# Altium project OSD335-X_Devboard.PrjPcb (part 1 of 3)
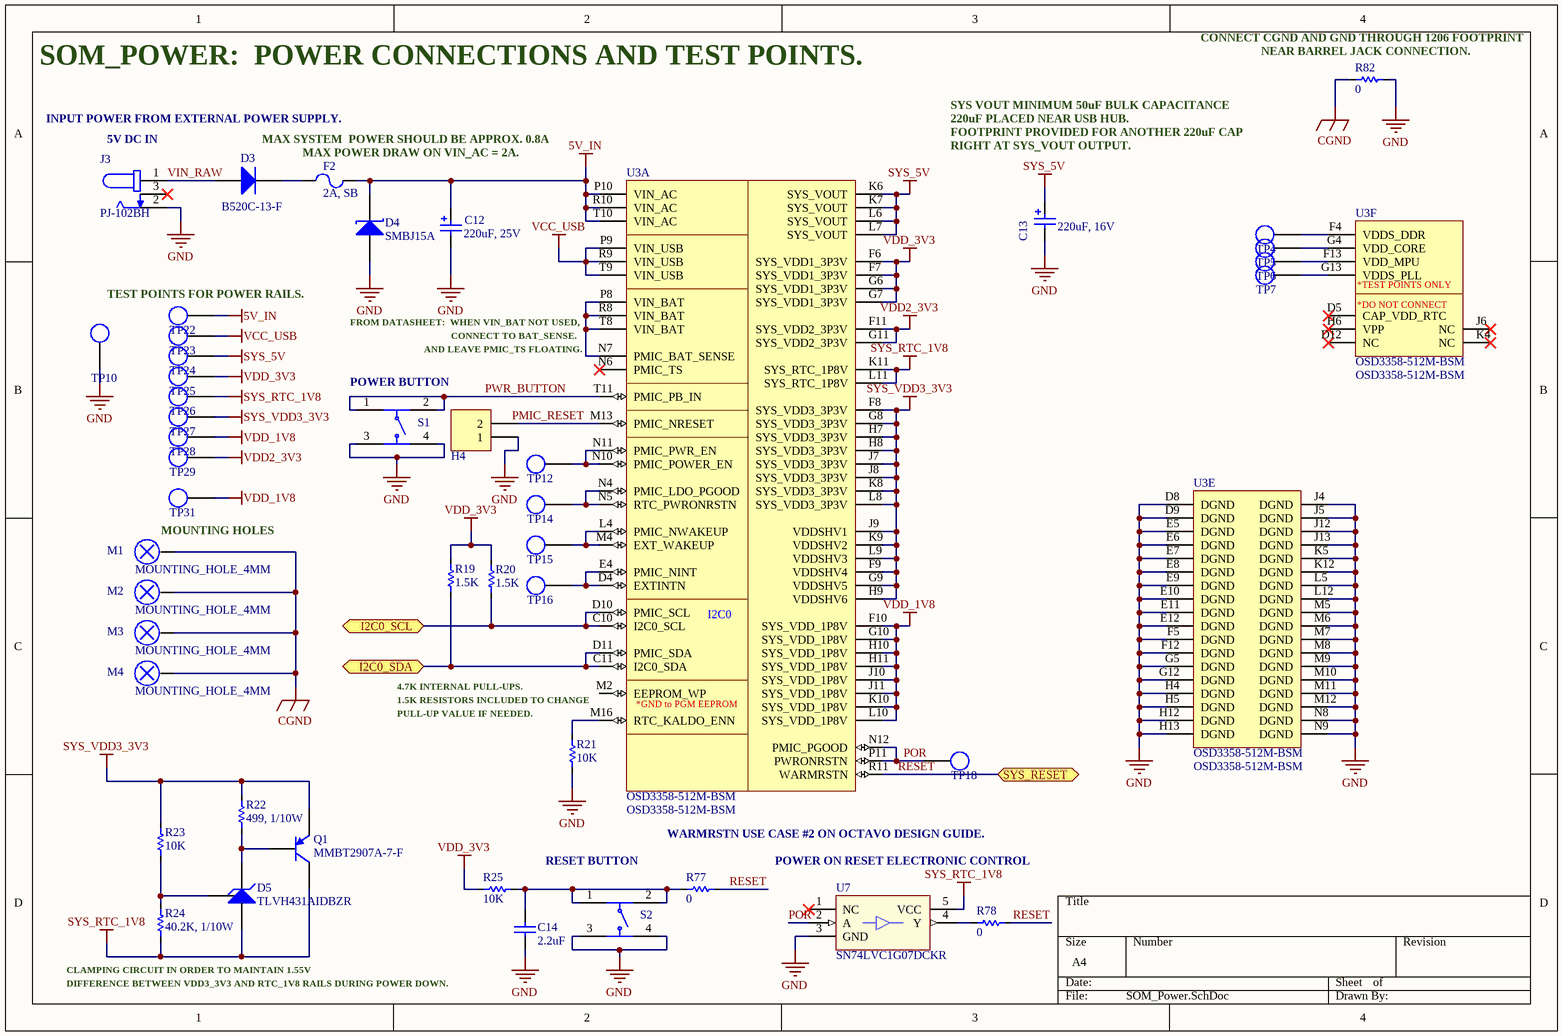
[diagram p0: SOM_Power.SchDoc]
8 sheets, 281 parts. Net scope: flat (ports and power ports of the same name join across sheets).
Board file: OSD335-X_Devboard.PcbDoc
Sheets:
  SOM_Power.SchDoc
  SOM_IO1.SchDoc
  SOM_IO2.SchDoc
  SOM_IO3.SchDoc
  P03_UART_Debug.SchDoc
  HDMI.SchDoc
  P04_USB_hub.SchDoc
  P05_Ethernet.SchDoc

## Sheet SOM_Power.SchDoc
size A4

### Parts
C12  220uF, 25V  [CAP_SMD_6.3x7.7]
C13  220uF, 16V  [CAP_SMD_6.3x7.7]
C14  2.2uF  [CAP_0603]
D3  B520C-13-F  [D0-214AA]
D4  SMBJ15A  [D0-214AA]
D5  TLVH431AIDBZR  [SOT-23-3]
F2  2A, SB  [CAP_0603]
H4  02p  [HEADER_2X1_2.54MM]  (value not drawn)
J3  PJ-102BH  [PJ-102BH]
M1  MOUNTING_HOLE_4MM  [MOUNTING_HOLE_4MM]
M2  MOUNTING_HOLE_4MM  [MOUNTING_HOLE_4MM]
M3  MOUNTING_HOLE_4MM  [MOUNTING_HOLE_4MM]
M4  MOUNTING_HOLE_4MM  [MOUNTING_HOLE_4MM]
Q1  MMBT2907A-7-F  [SOT-23-3]
R19  1.5K  [RES_0603]
R20  1.5K  [RES_0603]
R21  10K  [RES_0603]
R22  499, 1/10W  [RES_0603]
R23  10K  [RES_0603]
R24  40.2K, 1/10W  [RES_0603]
R25  10K  [RES_0603]
R77  0  [RES_0603]
R78  0  [RES_0603]
R82  0  [RES_1206]
S1  PTS645SM43SMTR92 LFS  [SWITCH_6x6MM_SMT]  (value not drawn)
S2  PTS645SM43SMTR92 LFS  [SWITCH_6x6MM_SMT]  (value not drawn)
TP4  TP_SMD  [TP_SMD]  (value not drawn)
TP5  TP_SMD  [TP_SMD]  (value not drawn)
TP6  TP_SMD  [TP_SMD]  (value not drawn)
TP7  TP_SMD  [TP_SMD]  (value not drawn)
TP10  TP_SMD  [TP_SMD]  (value not drawn)
TP12  TP_SMD  [TP_SMD]  (value not drawn)
TP14  TP_SMD  [TP_SMD]  (value not drawn)
TP15  TP_SMD  [TP_SMD]  (value not drawn)
TP16  TP_SMD  [TP_SMD]  (value not drawn)
TP18  TP_SMD  [TP_SMD]  (value not drawn)
TP22  TP_SMD  [TP_SMD]  (value not drawn)
TP23  TP_SMD  [TP_SMD]  (value not drawn)
TP24  TP_SMD  [TP_SMD]  (value not drawn)
TP25  TP_SMD  [TP_SMD]  (value not drawn)
TP26  TP_SMD  [TP_SMD]  (value not drawn)
TP27  TP_SMD  [TP_SMD]  (value not drawn)
TP28  TP_SMD  [TP_SMD]  (value not drawn)
TP29  TP_SMD  [TP_SMD]  (value not drawn)
TP31  TP_SMD  [TP_SMD]  (value not drawn)
U3  OSD3358-512M-BSM  [BGA256C127P16X16_2100X2100X308]  (parts A,E,F of 6)
U7  SN74LVC1G07DCKR  [SC70]

### Ports
I2C0_SCL (bidir), I2C0_SDA (bidir), SYS_RESET (bidir)

### Nets
5V_IN: C12.2(P) D4.2(K) F2.2 TP22.1 U3.P10(VIN_AC) U3.R10(VIN_AC) U3.T10(VIN_AC)
CGND: M1.1 M2.1 M3.1 M4.1 R82.1
GND: C12.1(N) C13.1(N) C14.1 D4.1(A) H4.1 J3.2 R21.1 R82.2 S1.3 S1.4 S2.3 S2.4 TP10.1 U3.D8(DGND) U3.D9(DGND) U3.E5(DGND) U3.E6(DGND) U3.E7(DGND) U3.E8(DGND) U3.E9(DGND) U3.E10(DGND) U3.E11(DGND) U3.E12(DGND) U3.F5(DGND) U3.F12(DGND) U3.G5(DGND) U3.G12(DGND) U3.H4(DGND) U3.H5(DGND) U3.H12(DGND) U3.H13(DGND) U3.J4(DGND) U3.J5(DGND) U3.J12(DGND) U3.J13(DGND) U3.K5(DGND) U3.K12(DGND) U3.L5(DGND) U3.L12(DGND) U3.M5(DGND) U3.M6(DGND) U3.M7(DGND) U3.M8(DGND) U3.M9(DGND) U3.M10(DGND) U3.M11(DGND) U3.M12(DGND) U3.N8(DGND) U3.N9(DGND) U7.3(GND)
SYS_5V: C13.2(P) TP24.1 U3.K6(SYS_VOUT) U3.K7(SYS_VOUT) U3.L6(SYS_VOUT) U3.L7(SYS_VOUT)
SYS_RTC_1V8: D5.3(A) Q1.3(C) R24.1 TP26.1 U3.K11(SYS_RTC_1P8V) U3.L11(SYS_RTC_1P8V) U7.5(VCC)
SYS_VDD3_3V3: Q1.2(E) R22.2 R23.2 TP27.1 U3.F8(SYS_VDD3_3P3V) U3.F9(VDDSHV4) U3.G8(SYS_VDD3_3P3V) U3.G9(VDDSHV5) U3.H7(SYS_VDD3_3P3V) U3.H8(SYS_VDD3_3P3V) U3.H9(VDDSHV6) U3.J7(SYS_VDD3_3P3V) U3.J8(SYS_VDD3_3P3V) U3.J9(VDDSHV1) U3.K8(SYS_VDD3_3P3V) U3.K9(VDDSHV2) U3.L8(SYS_VDD3_3P3V) U3.L9(VDDSHV3)
VCC_USB: TP23.1 U3.P9(VIN_USB) U3.R9(VIN_USB) U3.T9(VIN_USB)
VDD2_3V3: TP29.1 U3.F11(SYS_VDD2_3P3V) U3.G11(SYS_VDD2_3P3V)
VDD_1V8: TP28.1 TP31.1 U3.F10(SYS_VDD_1P8V) U3.G10(SYS_VDD_1P8V) U3.H10(SYS_VDD_1P8V) U3.H11(SYS_VDD_1P8V) U3.J10(SYS_VDD_1P8V) U3.J11(SYS_VDD_1P8V) U3.K10(SYS_VDD_1P8V) U3.L10(SYS_VDD_1P8V)
VDD_3V3: R19.2 R20.2 R25.2 TP25.1 U3.F6(SYS_VDD1_3P3V) U3.F7(SYS_VDD1_3P3V) U3.G6(SYS_VDD1_3P3V) U3.G7(SYS_VDD1_3P3V)
PMIC_RESET: H4.2 U3.M13(PMIC_NRESET)
POR: TP18.1 U3.N12(PMIC_PGOOD) U3.P11(PWRONRSTN) U7.2(A)
PWR_BUTTON: S1.1 S1.2 U3.T11(PMIC_PB_IN)
RESET: R77.2 R78.2 U3.R11(WARMRSTN) ; port SYS_RESET
VIN_RAW: D3.1(A) J3.1
NetC14_2: C14.2 R25.1 R77.1 S2.1 S2.2
NetD3_2: D3.2(K) F2.1
NetD5_1: D5.1(C) Q1.1(B) R22.1
NetD5_2: D5.2(REF) R23.1 R24.2
NetR19_1: R19.1 U3.C11(I2C0_SDA) U3.D11(PMIC_SDA) ; port I2C0_SDA
NetR20_1: R20.1 U3.C10(I2C0_SCL) U3.D10(PMIC_SCL) ; port I2C0_SCL
NetR21_2: R21.2 U3.M16(RTC_KALDO_ENN)
NetR78_1: R78.1 U7.4(Y)
NetTP4_1: TP4.1 U3.F4(VDDS_DDR)
NetTP5_1: TP5.1 U3.G4(VDD_CORE)
NetTP6_1: TP6.1 U3.F13(VDD_MPU)
NetTP7_1: TP7.1 U3.G13(VDDS_PLL)
NetTP12_1: TP12.1 U3.N10(PMIC_POWER_EN) U3.N11(PMIC_PWR_EN)
NetTP14_1: TP14.1 U3.N4(PMIC_LDO_PGOOD) U3.N5(RTC_PWRONRSTN)
NetTP15_1: TP15.1 U3.L4(PMIC_NWAKEUP) U3.M4(EXT_WAKEUP)
NetTP16_1: TP16.1 U3.D4(EXTINTN) U3.E4(PMIC_NINT)
NetU3_N7: U3.N7(PMIC_BAT_SENSE) U3.P8(VIN_BAT) U3.R8(VIN_BAT) U3.T8(VIN_BAT)

Not connected (* = marked no-connect by the designer): J3 3*; U3 D5(CAP_VDD_RTC)* D12(NC)* H6(VPP)* J6(NC)* K4(NC)* M2(EEPROM_WP) N6(PMIC_TS)*; U7 1(NC)*

### Notes on the sheet
- (near R82) CONNECT CGND AND GND THROUGH 1206 FOOTPRINT
- SOM_POWER:  POWER CONNECTIONS AND TEST POINTS.
- SYS VOUT MINIMUM 50uF BULK CAPACITANCE
- (near R82) NEAR BARREL JACK CONNECTION.
- INPUT POWER FROM EXTERNAL POWER SUPPLY.
- (near J3) 5V DC IN
- MAX SYSTEM  POWER SHOULD BE APPROX. 0.8A
- (near F2) MAX POWER DRAW ON VIN_AC = 2A.
- 220uF PLACED NEAR USB HUB.
- FOOTPRINT PROVIDED FOR ANOTHER 220uF CAP
- RIGHT AT SYS_VOUT OUTPUT.
- (near TP22) TEST POINTS FOR POWER RAILS.
- FROM DATASHEET:  WHEN VIN_BAT NOT USED,
- (near S1) POWER BUTTON
- AND LEAVE PMIC_TS FLOATING.
- CONNECT TO BAT_SENSE.
- (near M1) MOUNTING HOLES
- 4.7K INTERNAL PULL-UPS.
- (near R21) 1.5K RESISTORS INCLUDED TO CHANGE
- PULL-UP VALUE IF NEEDED.
- WARMRSTN USE CASE #2 ON OCTAVO DESIGN GUIDE.
- RESET BUTTON
- POWER ON RESET ELECTRONIC CONTROL
- (near R24) CLAMPING CIRCUIT IN ORDER TO MAINTAIN 1.55V
- (near R24) DIFFERENCE BETWEEN VDD3_3V3 AND RTC_1V8 RAILS DURING POWER DOWN.
- (in symbol SOM-OSD3358-512M-BSM, part A) I2C0; *GND to PGM EEPROM
- (in symbol SOM-OSD3358-512M-BSM, part F) *TEST POINTS ONLY; *DO NOT CONNECT

### Library data of the parts
C12 = UCM1E221MCL1GS: CAP ALUM 220UF 20% 25V SMD; Manufacturer: Nichicon; Rated Voltage: 25 VDC; ComponentLink1Description: Manufacturer; ComponentLink1URL: http://www.we-online.de; ComponentLink2Description: Datasheet; ComponentLink2URL: https://katalog.we-online.com/pbs/datasheet/865080345012.pdf; Mounting Technology: SMD; Value: 220uF; Manufacturer Part No.: UCM1E221MCL1GS; Tolerance: 20%; Datasheet: https://www.nichicon.co.jp/english/products/pdfs/e-ucm.pdf; Supplier: Digi-Key; Supplier Part No.: 493-14530-1-ND; Package Description: 220µF 25V Aluminum Electrolytic Capacitors Radial, Can - SMD  2000 Hrs @ 105°C
C13 = 865080345012: CAP 220 UF 20% 16 V; Manufacturer: Wurth Elektronik; Rated Voltage: 16 VDC; ComponentLink1Description: Manufacturer; ComponentLink1URL: http://www.we-online.de; ComponentLink2Description: Datasheet; ComponentLink2URL: https://katalog.we-online.com/pbs/datasheet/865080345012.pdf; Mounting Technology: SMD; Value: 220uF; Manufacturer Part No.: 865080345012; Tolerance: 20%; Datasheet: *; Supplier: Digi-Key; Package Reference: CAP_SMD_6.3x7.7; Supplier Part No.: 732-8422-1-ND; Package Description: CAP_SMD_6.3x7.7
C14 = C0603C225M4PAC7867: CAP CER 2.2UF 16V X5R 0603; Manufacturer: KEMET; Manufacturer Part No.: C0603C104M4RACTU; Tolerance: 20%; ComponentLink1Description: Manufacturer; ComponentLink1URL: http://www.we-online.de; Value: 2.2uF; Rated Voltage: 16V; Ceramic Type: X5R; Supplier Part No.: 399-13136-1-ND; Package Reference: CAP_0603; Package Description: 0603; Mounting Technology: SMD; Datasheet: https://content.kemet.com/datasheets/KEM_C1002_X7R_SMD.pdf; Supplier: Digi-Key; ComponentLink2Description: Datasheet; ComponentLink2URL: https://content.kemet.com/datasheets/KEM_C1002_X7R_SMD.pdf
D3 = B520C-13-F: DIODE SCHOTTKY 20V 5A SMC; Manufacturer: Diodes Incorporated; Manufacturer Part No.: B520C-13-F; Package Description: Diode Schottky 20V 5A Surface Mount SMC; Package Reference: D0-214AA; Supplier: Digi-Key; Mounting Technology: SMD; Supplier Part No.: B520C-FDICT-ND; Datasheet: https://www.littelfuse.com/~/media/electronics/datasheets/tvs_diodes/littelfuse_tvs_diode_smbj_datasheet.pdf.pdf
D4 = SMBJ15A: TVS DIODE 15V 24.4V DO214AA; Manufacturer: Littelfuse Inc.; Manufacturer Part No.: SMBJ15A; Package Description: 24.4V Clamp 24.6A Ipp Tvs Diode Surface Mount DO-214AA (SMBJ); Package Reference: *; Supplier: Digi-Key; Mounting Technology: SMD; Supplier Part No.: SMBJ15ALFCT-ND; Datasheet: https://www.littelfuse.com/~/media/electronics/datasheets/tvs_diodes/littelfuse_tvs_diode_smbj_datasheet.pdf.pdf
D5 = TLVH431AIDBZR: IC VREF SHUNT 18V 1% SOT23-3; Manufacturer: Texas Instruments; Package Reference: SOT-23-3; Package Description: Shunt Voltage Reference IC 18V ±1%  SOT-23-3; Manufacturer Part No.: TLVH431AIDBZR; Supplier: Digi-Key; Datasheet: https://www.ti.com/lit/ds/symlink/tlvh431a.pdf; Supplier Part No.: 296-17970-1-ND; Mounting Technology: SMD
F2 = SF-0603S200-2: FUSE BOARD MOUNT 2A 32VDC 0603; Manufacturer: Bourns Inc.; ComponentLink1Description: Manufacturer Link; ComponentLink1URL: http://www.littelfuse.com/cgi-bin/r.cgi/en/brand_wickmann.html?LFSESSION=wIUUW1TXzO; ComponentLink2Description: Data Sheet; ComponentLink2URL: R:\Eclipse\ELE\PDF\Wickmann\Fuse TE-5 395.pdf; Date: 2020; Supplier: Digi-Key; Supplier Part No.: SF-0603S200-2CT-ND; Manufacturer Part No.: SF-0603S200-2; Mounting Technology: SMD; Package Description: 2A  AC 32V DC Fuse Board Mount (Cartridge Style Excluded) Surface Mount 0603 (1608 Metric); Package Reference: CAP_0603
H4 = 61300211121: CONN HEADER VERT 2POS 2.54MM; Manufacturer: Wurth Elektronik; ComponentLink1Description: Manufacturer; ComponentLink1URL: http://www.we-online.de; ComponentLink2Description: Datasheet; ComponentLink2URL: http://katalog.we-online.de/em/datasheet/6130xx11121.pdf; Supplier Part No.: 732-5315-ND; Supplier: Digi-Key; Package Reference: HEADER_2X1_2.54MM; Package Description: Header 2-pin 2.54mm 100mils; Mounting Technology: THRU; Manufacturer Part No.: 61300211121; Datasheet: https://www.we-online.de/katalog/datasheet/6130xx11121.pdf
J3 = PJ-102BH: CONN PWR JACK 2.5X5.5MM SOLDER; Manufacturer: CUI Devices; Current: 5A; Supplier Part No.: CP-102BH-ND; Manufacturer Part No.: PJ-102BH; Package Description: Power Barrel Connector Jack 2.50mm ID (0.098"), 5.50mm OD (0.217") Through Hole, Right Angle; Package Reference: PJ-102BH; Mounting Technology: THRU; Datasheet: https://www.cuidevices.com/product/resource/pj-102bh.pdf; Supplier: Digi-Key
Q1 = MMBT2907A: TRANS PNP 60V 0.6A SOT23-3; Manufacturer: Diodes Incorporated; Manufacturer Part No.: MMBT2907A-7-F; Supplier: Digi-Key; Mounting Technology: SMD; Supplier Part No.: MMBT2907A-FDICT-ND; Package Reference: SOT-23-3; Package Description: Bipolar (BJT) Transistor PNP 60V 600mA 200MHz 300mW Surface Mount SOT-23-3; Datasheet: https://media.digikey.com/pdf/Data%20Sheets/Diodes%20PDFs/MMBT2907A_Rev2016.pdf; Current: 0.6A
R19 R20 = RC0603FR-071K5L: RES SMD 1.5K OHM 1% 1/10W 0603; Manufacturer: Yageo; Tolerance: 1%; Manufacturer Part No.: RC0603FR-071K5L; Date: 2020; ComponentLink1Description: Manufacturer Link; ComponentLink1URL: http://www.vishay.com/company/brands/dale/; ComponentLink2Description: Datasheet; ComponentLink2URL: http://www.vishay.com/docs/20035/dcrcwe3.pdf; Supplier: Digikey; Supplier Part No.: 311-1.50KHRCT-ND; Datasheet: https://www.yageo.com/upload/media/product/productsearch/datasheet/rchip/PYu-RC_Group_51_RoHS_L_10.pdf; Package Reference: RES_0603; Package Description: 0603; Mounting Technology: SMD; Value: 1.5K; Power Rating: 1/10W
R21 R23 R25 = RC0603FR-0710KL: RES SMD 10K OHM 1% 1/10W 0603; Manufacturer: Yageo; Tolerance: 1%; Manufacturer Part No.: RC0603FR-0710KL; Date: 2020; ComponentLink1Description: Manufacturer Link; ComponentLink1URL: http://www.vishay.com/company/brands/dale/; ComponentLink2Description: Datasheet; ComponentLink2URL: http://www.vishay.com/docs/20035/dcrcwe3.pdf; Supplier: Digikey; Supplier Part No.: 311-10.0KHRCT-ND; Datasheet: https://www.yageo.com/upload/media/product/productsearch/datasheet/rchip/PYu-RC_Group_51_RoHS_L_10.pdf; Package Reference: RES_0603; Package Description: 0603; Mounting Technology: SMD; Value: 10K; Power Rating: 1/10W
R22 = RC0603FR-07499RL: RES SMD 499 OHM 1% 1/10W 0603; Manufacturer: Yageo; Value: 499; Tolerance: 1%; Manufacturer Part No.: RC0603FR-07499RL; Date: 2020; ComponentLink1Description: Manufacturer Link; ComponentLink1URL: http://www.vishay.com/company/brands/dale/; ComponentLink2Description: Datasheet; ComponentLink2URL: http://www.vishay.com/docs/20035/dcrcwe3.pdf; Supplier: Digikey; Supplier Part No.: 311-499HRCT-ND; Datasheet: https://www.yageo.com/upload/media/product/productsearch/datasheet/rchip/PYu-RC_Group_51_RoHS_L_10.pdf; Package Reference: RES_0603; Package Description: 0603; Mounting Technology: SMD; Power Rating: 1/10W
R24 = RC0603FR-0740K2L: RES SMD 40.2K OHM 1% 1/10W 0603; Manufacturer: Yageo; Tolerance: 1%; Manufacturer Part No.: RC0603FR-0740K2L; Date: 2020; ComponentLink1Description: Manufacturer Link; ComponentLink1URL: http://www.vishay.com/company/brands/dale/; ComponentLink2Description: Datasheet; ComponentLink2URL: http://www.vishay.com/docs/20035/dcrcwe3.pdf; Supplier: Digikey; Supplier Part No.: 311-40.2KHRCT-ND; Datasheet: https://www.yageo.com/upload/media/product/productsearch/datasheet/rchip/PYu-RC_Group_51_RoHS_L_10.pdf; Package Reference: RES_0603; Package Description: 0603; Mounting Technology: SMD; Value: 40.2K; Power Rating: 1/10W
R77 R78 = RC0603JR-070RL: RES SMD 0 OHM JUMPER 1/10W 0603; Manufacturer: Yageo; Manufacturer Part No.: RC0603JR-070RL; Date: 2020; ComponentLink1Description: Manufacturer Link; ComponentLink1URL: http://www.vishay.com/company/brands/dale/; ComponentLink2Description: Datasheet; ComponentLink2URL: http://www.vishay.com/docs/20035/dcrcwe3.pdf; Supplier: Digikey; Supplier Part No.: 311-0.0GRCT-ND; Datasheet: https://www.yageo.com/upload/media/product/productsearch/datasheet/rchip/PYu-RC_Group_51_RoHS_L_10.pdf; Package Reference: RES_0603; Package Description: 0603; Mounting Technology: SMD; Value: 0; Power Rating: 1/10W
R82 = WSL120600000ZEA9: RES 0 OHM JUMPER 1206; Manufacturer: Vishay Dale; Power Rating: 1/4W; Tolerance: 0; Manufacturer Part No.: WSL120600000ZEA9; Date: 2020; ComponentLink1Description: Manufacturer Link; ComponentLink1URL: http://www.vishay.com/company/brands/dale/; ComponentLink2Description: Datasheet; ComponentLink2URL: http://www.vishay.com/docs/20035/dcrcwe3.pdf; Supplier: Digikey; Supplier Part No.: 541-3929-1-ND; Datasheet: http://www.vishay.com/docs/30192/wsl-9.pdf; Package Reference: RES_1206; Package Description: 1206; Mounting Technology: SMD; Value: 0
S1 S2 = PTS645SM43SMTR92 LFS: SWITCH TACTILE SPST-NO 0.05A 12V; Manufacturer: C&K; ComponentLink1Description: Manufacturer; ComponentLink1URL: http://www.we-online.de; ComponentLink2Description: Datasheet; ComponentLink2URL: http://katalog.we-online.de/em/datasheet/4301x2xxx8x6.pdf; Supplier: Digikey; Supplier Part No.: CKN9112CT-ND; Manufacturer Part No.: PTS645SM43SMTR92 LFS; Package Description: 6x6mm SMT Switch, 4.3mm height; Mounting Technology: SMD; Datasheet: https://dznh3ojzb2azq.cloudfront.net/products/Tactile/PTS645/documents/datasheet.pdf; Package Reference: SWITCH_6x6MM_SMT
U3 = SOM-OSD3358-512M-BSM: OSD3358-512M-BSM , 256-FBGA, 21mmx21mmx3mm; Manufacturer: Octavo Systems; Package: FBGA; Pin Count: 256-ball; Mounting Technology: SMD; ComponentLink1Description: Manufacturer URL; ComponentLink1URL: http://www.octavosystems.com/; PartNumber: OSD3358-512M-BSM; Package Description: 256-Ball Grid Array, 21x21x3 mm, Pitch 1.27 mm; Package Reference: FBGA-256; Supplier: Digi-Key; Supplier Part No.: 1676-1002-ND
U7 = SN74LVC1G07DCKR: IC BUF NON-INVERT 5.5V SC70-5; Manufacturer: Texas Instruments; Supplier: Digi-Key; Supplier Part No.: 296-8486-1-ND; Manufacturer Part No.: SN74LVC1G07DCKR; Mounting Technology: SMD; Package Reference: *; Package Description: Buffer, Non-Inverting 1 Element 1 Bit per Element Open Drain Output SC-70-5; ComponentLink1Description: Datasheet; ComponentLink1URL: https://www.ti.com/lit/ds/symlink/sn74lvc1g07.pdf

## Sheet SOM_IO1.SchDoc
size A4
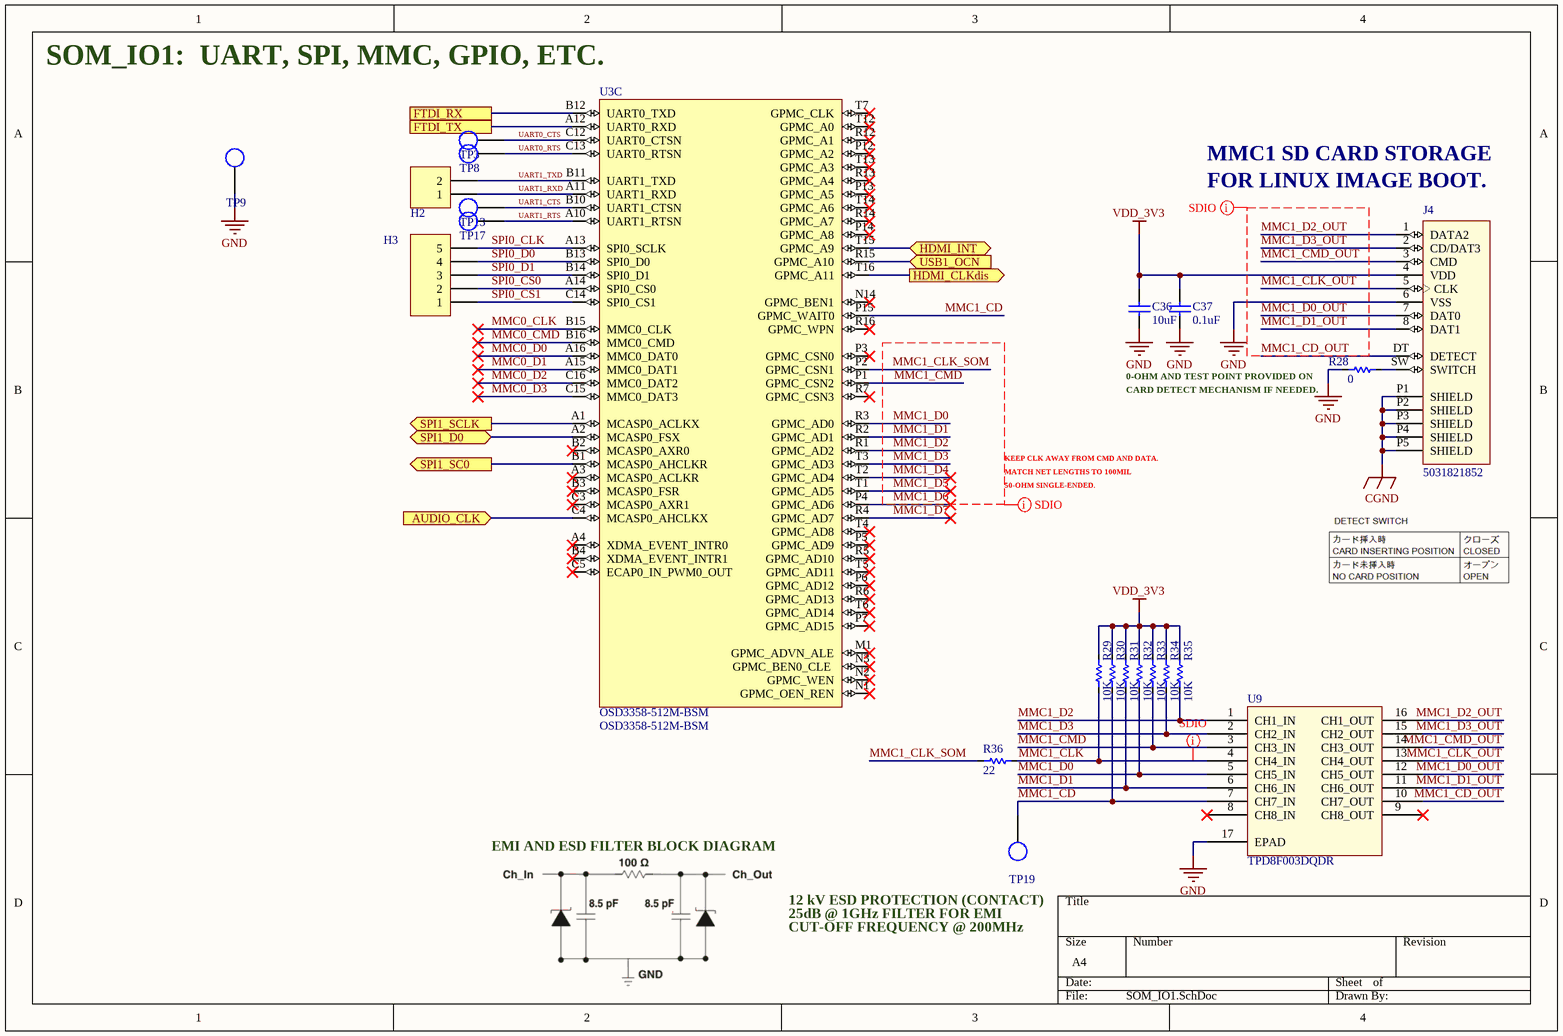
[diagram p1: SOM_IO1.SchDoc]

### Parts
C36  10uF  [CAP_0603]
C37  0.1uF  [CAP_0603]
H2  02p  [HEADER_2X1_2.54MM]  (value not drawn)
H3  06p  [HEADER_5X1_2.54MM]  (value not drawn)
J4  5031821852  [5031821852]
R28  0  [RES_0603]
R29  10K  [RES_0603]
R30  10K  [RES_0603]
R31  10K  [RES_0603]
R32  10K  [RES_0603]
R33  10K  [RES_0603]
R34  10K  [RES_0603]
R35  10K  [RES_0603]
R36  22  [RES_0603]
TP3  TP_SMD  [TP_SMD]  (value not drawn)
TP8  TP_SMD  [TP_SMD]  (value not drawn)
TP9  TP_SMD  [TP_SMD]  (value not drawn)
TP13  TP_SMD  [TP_SMD]  (value not drawn)
TP17  TP_SMD  [TP_SMD]  (value not drawn)
TP19  TP_SMD  [TP_SMD]  (value not drawn)
U3  OSD3358-512M-BSM  [BGA256C127P16X16_2100X2100X308]  (part C of 6)
U9  TPD8F003DQDR  [WSON-16_3.3MMX1.35MM]

### Ports
AUDIO_CLK (in), FTDI_RX, FTDI_TX, HDMI_CLKdis (out), HDMI_INT (bidir), SPI1_D0 (bidir), SPI1_SC0 (out), SPI1_SCLK (out), USB1_OCN (in)

### Nets
CGND: J4.P1(SHIELD) J4.P2(SHIELD) J4.P3(SHIELD) J4.P4(SHIELD) J4.P5(SHIELD)
GND: C36.1 C37.1 J4.6(VSS) R28.1 TP9.1 U9.17(EPAD)
VDD_3V3: C36.2 C37.2 J4.4(VDD) R29.2 R30.2 R31.2 R32.2 R33.2 R34.2 R35.2
MMC0_CLK: U3.B15(MMC0_CLK)
MMC0_CMD: U3.B16(MMC0_CMD)
MMC0_D0: U3.A16(MMC0_DAT0)
MMC0_D1: U3.A15(MMC0_DAT1)
MMC0_D2: U3.C16(MMC0_DAT2)
MMC0_D3: U3.C15(MMC0_DAT3)
MMC1_CD: R30.1 TP19.1 U3.P15(GPMC_WAIT0) U9.7(CH7_IN)
MMC1_CD_OUT: J4.DT(DETECT) U9.10(CH7_OUT)
MMC1_CLK: R29.1 R36.2 U9.4(CH4_IN)
MMC1_CLK_OUT: J4.5(CLK) U9.13(CH4_OUT)
MMC1_CLK_SOM: R36.1 U3.P2(GPMC_CSN1)
MMC1_CMD: R33.1 U3.P1(GPMC_CSN2) U9.3(CH3_IN)
MMC1_CMD_OUT: J4.3(CMD) U9.14(CH3_OUT)
MMC1_D0: R32.1 U3.R3(GPMC_AD0) U9.5(CH5_IN)
MMC1_D0_OUT: J4.7(DAT0) U9.12(CH5_OUT)
MMC1_D1: R31.1 U3.R2(GPMC_AD1) U9.6(CH6_IN)
MMC1_D1_OUT: J4.8(DAT1) U9.11(CH6_OUT)
MMC1_D2: R35.1 U3.R1(GPMC_AD2) U9.1(CH1_IN)
MMC1_D2_OUT: J4.1(DATA2) U9.16(CH1_OUT)
MMC1_D3: R34.1 U3.T3(GPMC_AD3) U9.2(CH2_IN)
MMC1_D3_OUT: J4.2(CD/DAT3) U9.15(CH2_OUT)
MMC1_D4: U3.T2(GPMC_AD4)
MMC1_D5: U3.T1(GPMC_AD5)
MMC1_D6: U3.P4(GPMC_AD6)
MMC1_D7: U3.R4(GPMC_AD7)
SPI0_CLK: H3.5 U3.A13(SPI0_SCLK)
SPI0_CS0: H3.2 U3.A14(SPI0_CS0)
SPI0_CS1: H3.1 U3.C14(SPI0_CS1)
SPI0_D0: H3.4 U3.B13(SPI0_D0)
SPI0_D1: H3.3 U3.B14(SPI0_D1)
UART0_CTS: TP3.1 U3.C12(UART0_CTSN)
UART0_RTS: TP8.1 U3.C13(UART0_RTSN)
UART1_CTS: TP13.1 U3.B10(UART1_CTSN)
UART1_RTS: TP17.1 U3.A10(UART1_RTSN)
UART1_RXD: H2.1 U3.A11(UART1_RXD)
UART1_TXD: H2.2 U3.B11(UART1_TXD)
NetJ4_SW: J4.SW(SWITCH) R28.2
NetR4_1: U3.T15(GPMC_A9) ; port HDMI_INT
NetR17_2: U3.C4(MCASP0_AHCLKX) ; port AUDIO_CLK
NetR79_1: U3.R15(GPMC_A10) ; port USB1_OCN
NetTP1_1: U3.A12(UART0_RXD) ; port FTDI_TX
NetTP2_1: U3.B12(UART0_TXD) ; port FTDI_RX
NetU1_23: U3.A1(MCASP0_ACLKX) ; port SPI1_SCLK
NetU1_24: U3.A2(MCASP0_FSX) ; port SPI1_D0
NetU1_25: U3.B1(MCASP0_AHCLKR) ; port SPI1_SC0
NetU3_T16: U3.T16(GPMC_A11) ; port HDMI_CLKdis

Not connected (* = marked no-connect by the designer): U3 A3(MCASP0_ACLKR)* A4(XDMA_EVENT_INTR0)* B2(MCASP0_AXR0)* B3(MCASP0_FSR)* B4(XDMA_EVENT_INTR1)* C3(MCASP0_AXR1)* C5(ECAP0_IN_PWM0_OUT)* M1(GPMC_ADVN_ALE)* N1(GPMC_OEN_REN)* N2(GPMC_WEN)* N3(GPMC_BEN0_CLE_)* N14(GPMC_BEN1)* P3(GPMC_CSN0)* P5(GPMC_AD9)* P6(GPMC_AD12)* P7(GPMC_AD15)* P12(GPMC_A2)* P13(GPMC_A5)* P14(GPMC_A8)* R5(GPMC_AD10)* R6(GPMC_AD13)* R7(GPMC_CSN3)* R12(GPMC_A1)* R13(GPMC_A4)* R14(GPMC_A7)* R16(GPMC_WPN)* T4(GPMC_AD8)* T5(GPMC_AD11)* T6(GPMC_AD14)* T7(GPMC_CLK)* T12(GPMC_A0)* T13(GPMC_A3)* T14(GPMC_A6)*; U9 8(CH8_IN)* 9(CH8_OUT)*

### Layout directives
net class SDIO1; net class Z50_SINGLE; rule Matched Net Lengths [Tolerance = 100mil]: MMC1_CD_OUT, MMC1_CLK, MMC1_CLK_OUT, MMC1_CLK_SOM, MMC1_CMD, MMC1_CMD_OUT, MMC1_D0, MMC1_D0_OUT, MMC1_D1, MMC1_D1_OUT, MMC1_D2, MMC1_D2_OUT, MMC1_D3, MMC1_D3_OUT, MMC1_D4, MMC1_D5, MMC1_D6

### Notes on the sheet
- SOM_IO1:  UART, SPI, MMC, GPIO, ETC.
- MMC1 SD CARD STORAGE
- (near J4) FOR LINUX IMAGE BOOT.
- 0-OHM AND TEST POINT PROVIDED ON
- CARD DETECT MECHANISM IF NEEDED.
- MATCH NET LENGTHS TO 100MIL
- 50-OHM SINGLE-ENDED.
- KEEP CLK AWAY FROM CMD AND DATA.
- EMI AND ESD FILTER BLOCK DIAGRAM
- (near TP19) 12 kV ESD PROTECTION (CONTACT)
- 25dB @ 1GHz FILTER FOR EMI
- CUT-OFF FREQUENCY @ 200MHz

### Library data of the parts
C36 = C0603C106M8PAC7867: CAP CER 10UF 10V X5R 0603; Manufacturer: KEMET; Ceramic Type: X7R; Tolerance: 20%; ComponentLink1Description: Manufacturer; ComponentLink1URL: http://www.we-online.de; Value: 10uF; Rated Voltage: 10V; Supplier Part No.: 399-14945-1-ND; Package Reference: CAP_0603; Package Description: 0603; Mounting Technology: SMD; Manufacturer Part No.: C0603C106M8PAC7867; Datasheet: https://content.kemet.com/datasheets/KEM_C1002_X7R_SMD.pdf; Supplier: Digi-Key; ComponentLink2Description: Datasheet; ComponentLink2URL: https://content.kemet.com/datasheets/KEM_C1002_X7R_SMD.pdf
C37 = C0603C104M4RACTU: CAP CER 0.1UF 16V X7R 0603; Manufacturer: KEMET; Tolerance: 20%; ComponentLink1Description: Manufacturer; ComponentLink1URL: http://www.we-online.de; Value: 0.1uF; Rated Voltage: 16V; Ceramic Type: X7R; Supplier Part No.: 399-1099-1-ND; Package Reference: CAP_0603; Package Description: 0603; Mounting Technology: SMD; Manufacturer Part No.: C0603C104M4RACTU; Datasheet: https://content.kemet.com/datasheets/KEM_C1002_X7R_SMD.pdf; Supplier: Digi-Key; ComponentLink2Description: Datasheet; ComponentLink2URL: https://content.kemet.com/datasheets/KEM_C1002_X7R_SMD.pdf
H2 = 61300211121: as H4 on sheet SOM_Power; ComponentLink1Description: Manufacturer; ComponentLink1URL: http://www.we-online.de; ComponentLink2Description: Datasheet; ComponentLink2URL: http://katalog.we-online.de/em/datasheet/6130xx11121.pdf; Supplier Part No.: 732-5315-ND; Supplier: Digi-Key; Package Reference: HEADER_2X1_2.54MM; Package Description: Header 2-pin 2.54mm 100mils; Mounting Technology: THRU; Manufacturer Part No.: 61300211121; Datasheet: https://www.we-online.de/katalog/datasheet/6130xx11121.pdf
H3 = 61300511121: CONN HEADER VERT 6POS 2.54MM; Manufacturer: Wurth Elektronik; Supplier: Digi-Key; ComponentLink1Description: Manufacturer; ComponentLink1URL: http://www.we-online.de; ComponentLink2Description: Datasheet; ComponentLink2URL: http://katalog.we-online.de/em/datasheet/6130xx11121.pdf; Manufacturer Part No.: 61300511121; Supplier Part No.: 732-5318-ND; Datasheet: https://www.we-online.de/katalog/datasheet/6130xx11121.pdf; Package Reference: HEADER_5X1_2.54MM; Mounting Technology: THRU; Package Description: Header, 5-pin, single-row, 2.54mm/0.100" pitch
J4 = 5031821852: MICRO SD NORMAL ULTRALOWPRO8CKTE; Manufacturer: Molex; Supplier: Digi-Key; Manufacturer Part No.: 5031821852; Supplier Part No.: WM12834CT-ND; Datasheet: *; Package Description: 10 (8 + 2) Position Card Connector microSD™ Surface Mount, Right Angle Gold; Package Reference: 5031821852; Mounting Technology: SMD
R28 = RC0603JR-070RL: as R77 on sheet SOM_Power; Manufacturer Part No.: RC0603JR-070RL; Date: 2020; ComponentLink1Description: Manufacturer Link; ComponentLink1URL: http://www.vishay.com/company/brands/dale/; ComponentLink2Description: Datasheet; ComponentLink2URL: http://www.vishay.com/docs/20035/dcrcwe3.pdf; Supplier: Digikey; Supplier Part No.: 311-0.0GRCT-ND; Datasheet: https://www.yageo.com/upload/media/product/productsearch/datasheet/rchip/PYu-RC_Group_51_RoHS_L_10.pdf; Package Reference: RES_0603; Package Description: 0603; Mounting Technology: SMD; Value: 0; Power Rating: 1/10W
R29-R35 = RC0603FR-0710KL: as R21 on sheet SOM_Power; Tolerance: 1%; Manufacturer Part No.: RC0603FR-0710KL; Date: 2020; ComponentLink1Description: Manufacturer Link; ComponentLink1URL: http://www.vishay.com/company/brands/dale/; ComponentLink2Description: Datasheet; ComponentLink2URL: http://www.vishay.com/docs/20035/dcrcwe3.pdf; Supplier: Digikey; Supplier Part No.: 311-10.0KHRCT-ND; Datasheet: https://www.yageo.com/upload/media/product/productsearch/datasheet/rchip/PYu-RC_Group_51_RoHS_L_10.pdf; Package Reference: RES_0603; Package Description: 0603; Mounting Technology: SMD; Value: 10K; Power Rating: 1/10W
R36 = RC0603JR-0722RL: RES SMD 22 OHM 5% 1/10W 0603; Manufacturer: Yageo; Tolerance: 5%; Manufacturer Part No.: RC0603JR-0722RL; Date: 2020; ComponentLink1Description: Manufacturer Link; ComponentLink1URL: http://www.vishay.com/company/brands/dale/; ComponentLink2Description: Datasheet; ComponentLink2URL: http://www.vishay.com/docs/20035/dcrcwe3.pdf; Supplier: Digikey; Supplier Part No.: 311-22GRCT-ND; Datasheet: https://www.yageo.com/upload/media/product/productsearch/datasheet/rchip/PYu-RC_Group_51_RoHS_L_10.pdf; Package Reference: RES_0603; Package Description: 0603; Mounting Technology: SMD; Power Rating: 1/10W; Value: 22
U3 = SOM-OSD3358-512M-BSM: as U3 on sheet SOM_Power; Package: FBGA; Pin Count: 256-ball; Mounting Technology: SMD; ComponentLink1Description: Manufacturer URL; ComponentLink1URL: http://www.octavosystems.com/; PartNumber: OSD3358-512M-BSM; Package Description: 256-Ball Grid Array, 21x21x3 mm, Pitch 1.27 mm; Package Reference: FBGA-256; Supplier: Digi-Key; Supplier Part No.: 1676-1002-ND
U9 = TPD8F003DQDR: FILTER RC(PI) 100 OHM/8.5PF SMD WITH ESD PROTECTION; Manufacturer: Texas Instruments; ESD Discharge (Contact): 12 kV; ESD Discharge (Air Gap): 20 kV; Cut-Off Frequency: 200 MHz; Attenuation: 25dB @ 1Ghz; Manufacturer Part No.: TPD8F003DQDR; Supplier: Digi-Key; Mounting Technology: SMD; Package Reference: 16-WFDFN Exposed Pad, 0.79mm height; Package Description: WSON-16_3.3MMX1.35MM; Datasheet: https://www.ti.com/lit/ds/symlink/tpd8f003.pdf; Supplier Part No.: 296-25803-1-ND

## Sheet SOM_IO2.SchDoc
size A4
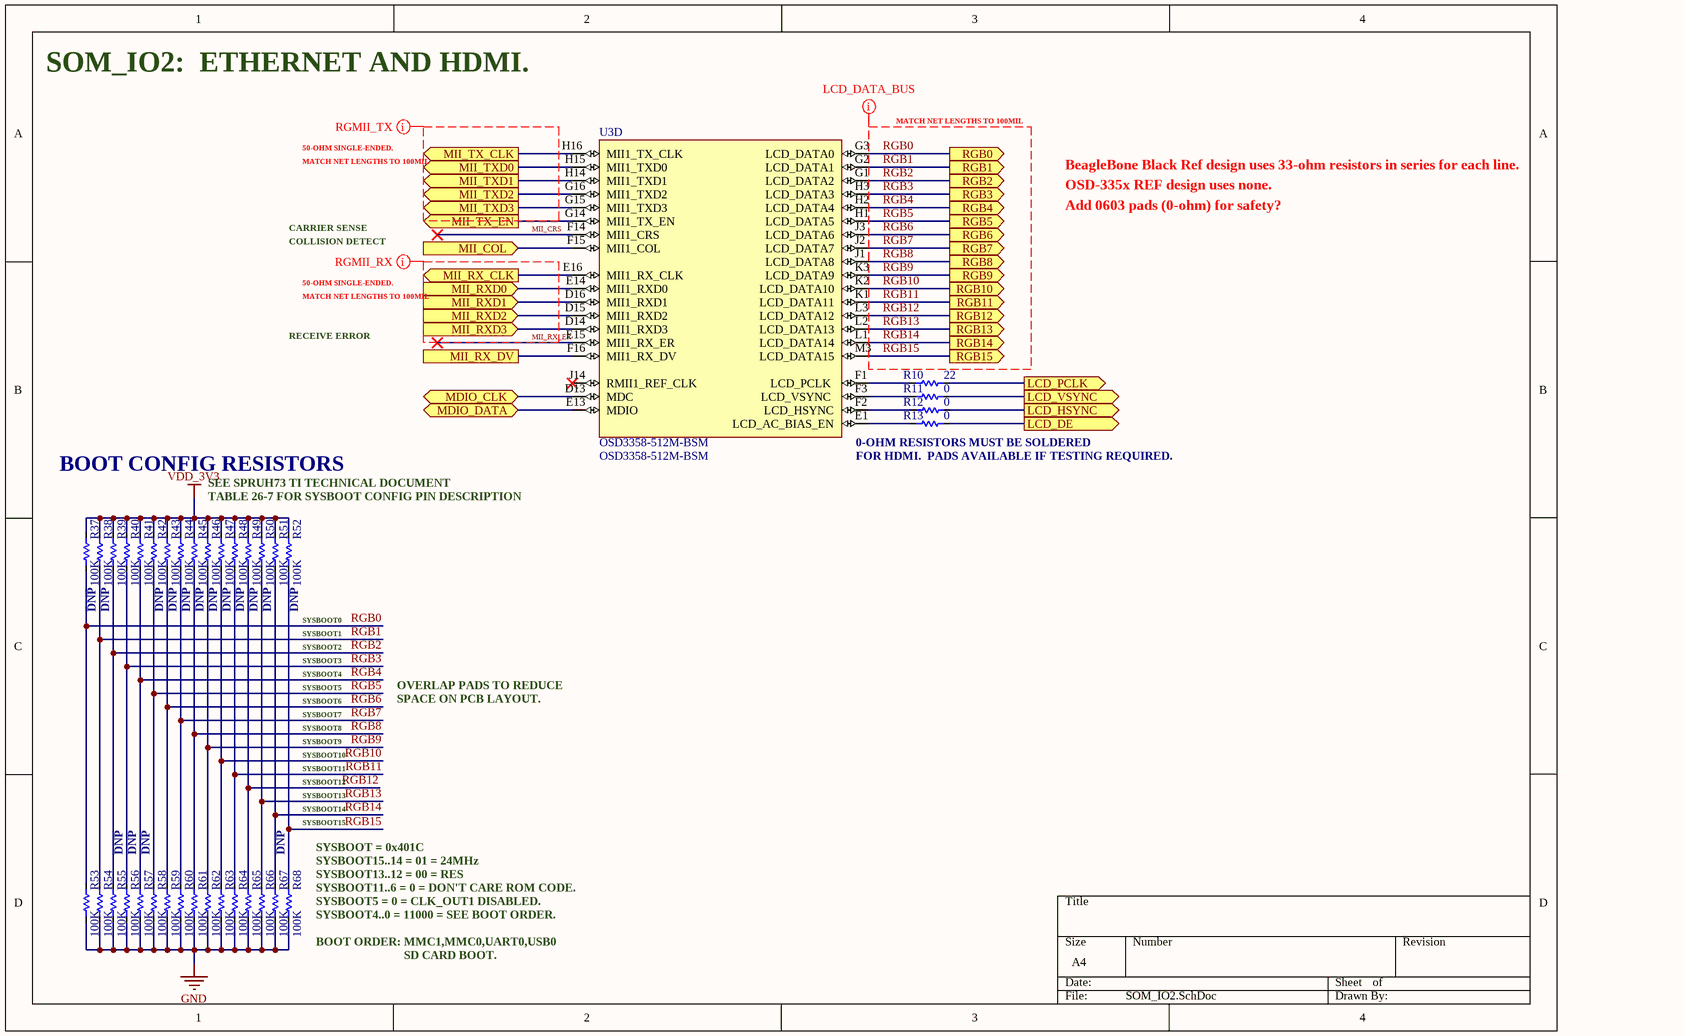
[diagram p2: SOM_IO2.SchDoc]

### Parts
R10  22  [RES_0603]
R11  0  [RES_0603]
R12  0  [RES_0603]
R13  0  [RES_0603]
R37  100K  [RES_0402]
R38  100K  [RES_0402]
R39  100K  [RES_0402]
R40  100K  [RES_0402]
R41  100K  [RES_0402]
R42  100K  [RES_0402]
R43  100K  [RES_0402]
R44  100K  [RES_0402]
R45  100K  [RES_0402]
R46  100K  [RES_0402]
R47  100K  [RES_0402]
R48  100K  [RES_0402]
R49  100K  [RES_0402]
R50  100K  [RES_0402]
R51  100K  [RES_0402]
R52  100K  [RES_0402]
R53  100K  [RES_0402]
R54  100K  [RES_0402]
R55  100K  [RES_0402]
R56  100K  [RES_0402]
R57  100K  [RES_0402]
R58  100K  [RES_0402]
R59  100K  [RES_0402]
R60  100K  [RES_0402]
R61  100K  [RES_0402]
R62  100K  [RES_0402]
R63  100K  [RES_0402]
R64  100K  [RES_0402]
R65  100K  [RES_0402]
R66  100K  [RES_0402]
R67  100K  [RES_0402]
R68  100K  [RES_0402]
U3  OSD3358-512M-BSM  [BGA256C127P16X16_2100X2100X308]  (part D of 6)

### Ports
LCD_DE (out), LCD_HSYNC (out), LCD_PCLK (out), LCD_VSYNC (out), MDIO_CLK (bidir), MDIO_DATA (bidir), MII_COL (in), MII_RX_CLK (out), MII_RX_DV, MII_RXD0 (in), MII_RXD1 (in), MII_RXD2 (in), MII_RXD3 (in), MII_TX_CLK (out), MII_TX_EN (out), MII_TXD0 (out), MII_TXD1 (out), MII_TXD2 (out), MII_TXD3 (out), RGB0 (out), RGB1 (out), RGB2 (out), RGB3 (out), RGB4 (out), RGB5 (out), RGB6 (out), RGB7 (out), RGB8 (out), RGB9 (out), RGB10 (out), RGB11 (out), RGB12 (out), RGB13 (out), RGB14 (out), RGB15 (out)

### Nets
GND: R53.1 R54.1 R55.1 R56.1 R57.1 R58.1 R59.1 R60.1 R61.1 R62.1 R63.1 R64.1 R65.1 R66.1 R67.1 R68.1
VDD_3V3: R37.2 R38.2 R39.2 R40.2 R41.2 R42.2 R43.2 R44.2 R45.2 R46.2 R47.2 R48.2 R49.2 R50.2 R51.2 R52.2
MII_CRS: U3.F14(MII1_CRS)
MII_RX_ER: U3.E15(MII1_RX_ER)
RGB0: R37.1 R53.2 U3.G3(LCD_DATA0) ; port RGB0
RGB1: R38.1 R54.2 U3.G2(LCD_DATA1) ; port RGB1
RGB2: R39.1 R55.2 U3.G1(LCD_DATA2) ; port RGB2
RGB3: R40.1 R56.2 U3.H3(LCD_DATA3) ; port RGB3
RGB4: R41.1 R57.2 U3.H2(LCD_DATA4) ; port RGB4
RGB5: R42.1 R58.2 U3.H1(LCD_DATA5) ; port RGB5
RGB6: R43.1 R59.2 U3.J3(LCD_DATA6) ; port RGB6
RGB7: R44.1 R60.2 U3.J2(LCD_DATA7) ; port RGB7
RGB8: R45.1 R61.2 U3.J1(LCD_DATA8) ; port RGB8
RGB9: R46.1 R62.2 U3.K3(LCD_DATA9) ; port RGB9
RGB10: R47.1 R63.2 U3.K2(LCD_DATA10) ; port RGB10
RGB11: R48.1 R64.2 U3.K1(LCD_DATA11) ; port RGB11
RGB12: R49.1 R65.2 U3.L3(LCD_DATA12) ; port RGB12
RGB13: R50.1 R66.2 U3.L2(LCD_DATA13) ; port RGB13
RGB14: R51.1 R67.2 U3.L1(LCD_DATA14) ; port RGB14
RGB15: R52.1 R68.2 U3.M3(LCD_DATA15) ; port RGB15
NetR10_1: R10.1 U3.F1(LCD_PCLK)
NetR10_2: R10.2 ; port LCD_PCLK
NetR11_1: R11.1 U3.F3(LCD_VSYNC)
NetR11_2: R11.2 ; port LCD_VSYNC
NetR12_1: R12.1 U3.F2(LCD_HSYNC)
NetR12_2: R12.2 ; port LCD_HSYNC
NetR13_1: R13.1 U3.E1(LCD_AC_BIAS_EN)
NetR13_2: R13.2 ; port LCD_DE
NetR91_1: U3.F15(MII1_COL) ; port MII_COL
NetR92_1: U3.D13(MDC) ; port MDIO_CLK
NetR93_1: U3.E13(MDIO) ; port MDIO_DATA
NetR95_1: U3.H16(MII1_TX_CLK) ; port MII_TX_CLK
NetR96_1: U3.G14(MII1_TX_EN) ; port MII_TX_EN
NetR97_1: U3.H15(MII1_TXD0) ; port MII_TXD0
NetR98_1: U3.H14(MII1_TXD1) ; port MII_TXD1
NetR99_1: U3.G16(MII1_TXD2) ; port MII_TXD2
NetR100_1: U3.G15(MII1_TXD3) ; port MII_TXD3
NetR101_1: U3.E16(MII1_RX_CLK) ; port MII_RX_CLK
NetR102_1: U3.F16(MII1_RX_DV) ; port MII_RX_DV
NetR103_1: U3.E14(MII1_RXD0) ; port MII_RXD0
NetR104_1: U3.D16(MII1_RXD1) ; port MII_RXD1
NetR105_1: U3.D15(MII1_RXD2) ; port MII_RXD2
NetR106_1: U3.D14(MII1_RXD3) ; port MII_RXD3

Not connected (* = marked no-connect by the designer): U3 J14(RMII1_REF_CLK)*

### Layout directives
net class RGMII_TX; net class Z50_SINGLE_RGMII; rule Matched Net Lengths [Tolerance = 100mil]: (no net found under the mark)
rule Matched Net Lengths [Tolerance = 100mil]; net class RGMII_RX; net class Z50_SINGLE_RGMII: MII_RX_ER
net class LCD_DATA_BUS; rule Matched Net Lengths [Tolerance = 100mil]: RGB0, RGB1, RGB2, RGB3, RGB4, RGB5, RGB6, RGB7, RGB8, RGB9, RGB10, RGB11, RGB12, RGB13, RGB14, RGB15

### Notes on the sheet
- SOM_IO2:  ETHERNET AND HDMI.
- MATCH NET LENGTHS TO 100MIL
- 50-OHM SINGLE-ENDED.
- BeagleBone Black Ref design uses 33-ohm resistors in series for each line.
- CARRIER SENSE
- COLLISION DETECT
- OSD-335x REF design uses none.
- Add 0603 pads (0-ohm) for safety?
- RECEIVE ERROR
- 0-OHM RESISTORS MUST BE SOLDERED
- BOOT CONFIG RESISTORS
- SEE SPRUH73 TI TECHNICAL DOCUMENT
- TABLE 26-7 FOR SYSBOOT CONFIG PIN DESCRIPTION
- FOR HDMI.  PADS AVAILABLE IF TESTING REQUIRED.
- DNP
- SYSBOOT0
- SYSBOOT1
- SYSBOOT2
- SYSBOOT3
- SYSBOOT4
- SYSBOOT5
- SYSBOOT6
- SYSBOOT7
- OVERLAP PADS TO REDUCE
- SPACE ON PCB LAYOUT.
- SYSBOOT8
- SYSBOOT9
- SYSBOOT10
- SYSBOOT11
- SYSBOOT12
- SYSBOOT13
- SYSBOOT14
- SYSBOOT15
- SYSBOOT = 0x401C
- SYSBOOT15..14 = 01 = 24MHz
- SYSBOOT13..12 = 00 = RES
- SYSBOOT11..6 = 0 = DON'T CARE ROM CODE.
- SYSBOOT5 = 0 = CLK_OUT1 DISABLED.
- SYSBOOT4..0 = 11000 = SEE BOOT ORDER.
- BOOT ORDER: MMC1,MMC0,UART0,USB0
- SD CARD BOOT.

### Library data of the parts
R10 = RC0603JR-0722RL: as R36 on sheet SOM_IO1; Tolerance: 5%; Manufacturer Part No.: RC0603JR-0722RL; Date: 2020; ComponentLink1Description: Manufacturer Link; ComponentLink1URL: http://www.vishay.com/company/brands/dale/; ComponentLink2Description: Datasheet; ComponentLink2URL: http://www.vishay.com/docs/20035/dcrcwe3.pdf; Supplier: Digikey; Supplier Part No.: 311-22GRCT-ND; Datasheet: https://www.yageo.com/upload/media/product/productsearch/datasheet/rchip/PYu-RC_Group_51_RoHS_L_10.pdf; Package Reference: RES_0603; Package Description: 0603; Mounting Technology: SMD; Power Rating: 1/10W; Value: 22
R11-R13 = RC0603JR-070RL: as R77 on sheet SOM_Power; Manufacturer Part No.: RC0603JR-070RL; Date: 2020; ComponentLink1Description: Manufacturer Link; ComponentLink1URL: http://www.vishay.com/company/brands/dale/; ComponentLink2Description: Datasheet; ComponentLink2URL: http://www.vishay.com/docs/20035/dcrcwe3.pdf; Supplier: Digikey; Supplier Part No.: 311-0.0GRCT-ND; Datasheet: https://www.yageo.com/upload/media/product/productsearch/datasheet/rchip/PYu-RC_Group_51_RoHS_L_10.pdf; Package Reference: RES_0603; Package Description: 0603; Mounting Technology: SMD; Value: 0; Power Rating: 1/10W
R37-R68 = RC0402FR-07100KL: RES SMD 100K OHM 1% 1/16W 0402; Manufacturer: Yageo; Tolerance: 1%; Manufacturer Part No.: RC0402FR-07100KL; Date: 2020; ComponentLink1Description: Manufacturer Link; ComponentLink1URL: http://www.vishay.com/company/brands/dale/; ComponentLink2Description: Datasheet; ComponentLink2URL: http://www.vishay.com/docs/20035/dcrcwe3.pdf; Supplier: Digikey; Supplier Part No.: 311-100KLRCT-ND; Datasheet: https://www.yageo.com/upload/media/product/productsearch/datasheet/rchip/PYu-RC_Group_51_RoHS_L_10.pdf; Package Reference: RES_0402; Package Description: 0402; Mounting Technology: SMD; Value: 100K; Power Rating: 1/16W
U3 = SOM-OSD3358-512M-BSM: as U3 on sheet SOM_Power; Package: FBGA; Pin Count: 256-ball; Mounting Technology: SMD; ComponentLink1Description: Manufacturer URL; ComponentLink1URL: http://www.octavosystems.com/; PartNumber: OSD3358-512M-BSM; Package Description: 256-Ball Grid Array, 21x21x3 mm, Pitch 1.27 mm; Package Reference: FBGA-256; Supplier: Digi-Key; Supplier Part No.: 1676-1002-ND

## Sheet SOM_IO3.SchDoc
size A4
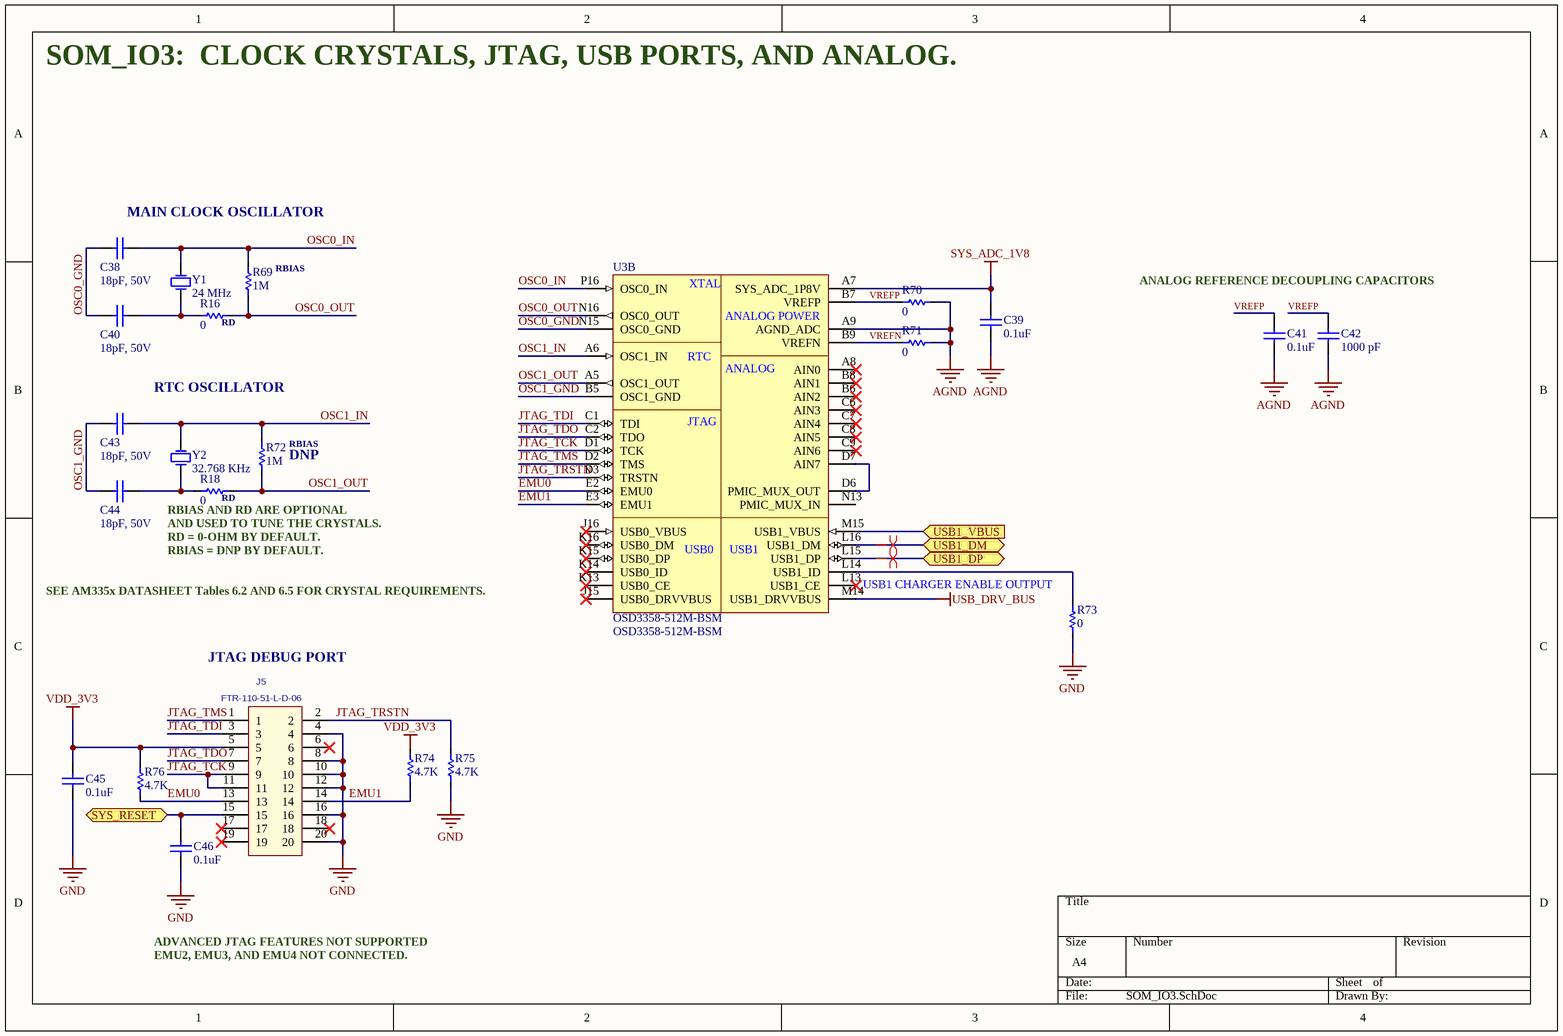
[diagram p3: SOM_IO3.SchDoc]

### Parts
C38  18pF, 50V  [CAP_0603]
C39  0.1uF  [CAP_0603]
C40  18pF, 50V  [CAP_0603]
C41  0.1uF  [CAP_0603]
C42  1000 pF  [CAP_0603]
C43  18pF, 50V  [CAP_0603]
C44  18pF, 50V  [CAP_0603]
C45  0.1uF  [CAP_0603]
C46  0.1uF  [CAP_0603]
J5  FTR-110-51-L-D-06  [HEADER_2X10_1.7MM]
R16  0  [RES_0603]
R18  0  [RES_0603]
R69  1M  [RES_0603]
R70  0  [RES_0603]
R71  0  [RES_0603]
R72  1M  [RES_0603]
R73  0  [RES_0603]
R74  4.7K  [RES_0603]
R75  4.7K  [RES_0603]
R76  4.7K  [RES_0603]
U3  OSD3358-512M-BSM  [BGA256C127P16X16_2100X2100X308]  (part B of 6)
Y1  24 MHz  [7A-24MHz]
Y2  32.768 KHz  [ABS07]

### Ports
SYS_RESET (bidir), USB1_DM (bidir), USB1_DP (bidir), USB1_VBUS (in)

### Nets
AGND: C39.1 C41.1 C42.1 R70.2 R71.2 U3.A9(AGND_ADC)
GND: C45.1 C46.1 J5.4 J5.8 J5.10 J5.12 J5.16 J5.20 R73.2 R75.1
SYS_ADC_1V8: C39.2 U3.A7(SYS_ADC_1P8V)
USB_DRV_BUS: U3.M14(USB1_DRVVBUS)
VDD_3V3: C45.2 J5.5 R74.2 R76.2
EMU0: J5.13 R76.1 U3.E2(EMU0)
EMU1: J5.14 R74.1 U3.E3(EMU1)
JTAG_TCK: J5.9 J5.11 U3.D1(TCK)
JTAG_TDI: J5.3 U3.C1(TDI)
JTAG_TDO: J5.7 U3.C2(TDO)
JTAG_TMS: J5.1 U3.D2(TMS)
JTAG_TRSTN: J5.2 R75.2 U3.D3(TRSTN)
OSC0_GND: C38.2(P) C40.2(P) U3.N15(OSC0_GND)
OSC0_IN: C38.1(N) R69.2 U3.P16(OSC0_IN) Y1.2(OSC2)
OSC0_OUT: R16.2 R69.1 U3.N16(OSC0_OUT)
OSC1_GND: C43.2(P) C44.2(P) U3.B5(OSC1_GND)
OSC1_IN: C43.1(N) R72.2 U3.A6(OSC1_IN) Y2.2(OSC2)
OSC1_OUT: R18.2 R72.1 U3.A5(OSC1_OUT)
RESET: C46.2 J5.15 ; port SYS_RESET
USB1_N: U3.L16(USB1_DM) ; port USB1_DM
USB1_P: U3.L15(USB1_DP) ; port USB1_DP
VREFN: R71.1 U3.B9(VREFN)
VREFP: C41.2 C42.2 R70.1 U3.B7(VREFP)
NetC40_1: C40.1(N) R16.1 Y1.1(OSC1)
NetC44_1: C44.1(N) R18.1 Y2.1(OSC1)
NetFB2_1: U3.M15(USB1_VBUS) ; port USB1_VBUS
NetR73_1: R73.1 U3.L14(USB1_ID)
NetU3_D6: U3.D6(PMIC_MUX_OUT) U3.D7(AIN7)

Not connected (* = marked no-connect by the designer): J5 6* 17* 18* 19*; U3 A8(AIN0)* B6(AIN2)* B8(AIN1)* C6(AIN3)* C7(AIN4)* C8(AIN5)* C9(AIN6)* J15(USB0_DRVVBUS)* J16(USB0_VBUS)* K13(USB0_CE)* K14(USB0_ID)* K15(USB0_DP)* K16(USB0_DM)* L13(USB1_CE)* N13(PMIC_MUX_IN)

### Layout directives
differential pair; net class Z90_DIFF; differential pair class USB: USB1_N, USB1_P

### Notes on the sheet
- SOM_IO3:  CLOCK CRYSTALS, JTAG, USB PORTS, AND ANALOG.
- (near C38) MAIN CLOCK OSCILLATOR
- (near R69) RBIAS
- ANALOG REFERENCE DECOUPLING CAPACITORS
- (near R16) RD
- RTC OSCILLATOR
- (near R72) RBIAS
- (near R18) RBIAS AND RD ARE OPTIONAL
- (near R18) RD
- (near R72) DNP
- (near R18) AND USED TO TUNE THE CRYSTALS.
- RD = 0-OHM BY DEFAULT.
- RBIAS = DNP BY DEFAULT.
- SEE AM335x DATASHEET Tables 6.2 AND 6.5 FOR CRYSTAL REQUIREMENTS.
- USB1 CHARGER ENABLE OUTPUT
- JTAG DEBUG PORT
- ADVANCED JTAG FEATURES NOT SUPPORTED
- EMU2, EMU3, AND EMU4 NOT CONNECTED.
- (in symbol SOM-OSD3358-512M-BSM, part B) XTAL; ANALOG POWER; RTC /; ANALOG; JTAG; USB0; USB1

### Library data of the parts
C38 C40 C43 C44 = C0603C180D5GACTU: CAP CER 18PF 50V C0G/NP0 0603 +/- 0.5 PF; Manufacturer: KEMET; Tolerance: 0.5 pF; Rated Voltage: 50 VDC; ComponentLink1Description: Manufacturer; ComponentLink1URL: http://www.we-online.de; ComponentLink2Description: Datasheet; ComponentLink2URL: https://katalog.we-online.com/pbs/datasheet/865080345012.pdf; Mounting Technology: SMD; Value: 18 pF; Manufacturer Part No.: C0603C180D5GACTU; Datasheet: *; Supplier: Digi-Key; Package Reference: CAP_0603; Supplier Part No.: 399-9018-1-ND; Package Description: 0603
C39 C41 C45 C46 = C0603C104M4RACTU: as C37 on sheet SOM_IO1; ComponentLink1Description: Manufacturer; ComponentLink1URL: http://www.we-online.de; Value: 0.1uF; Rated Voltage: 16V; Ceramic Type: X7R; Supplier Part No.: 399-1099-1-ND; Package Reference: CAP_0603; Package Description: 0603; Mounting Technology: SMD; Manufacturer Part No.: C0603C104M4RACTU; Datasheet: https://content.kemet.com/datasheets/KEM_C1002_X7R_SMD.pdf; Supplier: Digi-Key; ComponentLink2Description: Datasheet; ComponentLink2URL: https://content.kemet.com/datasheets/KEM_C1002_X7R_SMD.pdf
C42 = C0603X102J4RECAUTO: CAP CER 0603 1NF 16V X7R 5%; Manufacturer: KEMET; ComponentLink1Description: Manufacturer; ComponentLink1URL: http://www.we-online.de; Value: 1000 pF; Rated Voltage: 16V; Ceramic Type: X7R; Supplier Part No.: 399-17840-1-ND; Package Reference: CAP_0603; Package Description: 0603; Mounting Technology: SMD; Manufacturer Part No.: C0603X102J4RECAUTO; Datasheet: https://content.kemet.com/datasheets/KEM_C1002_X7R_SMD.pdf; Tolerance: 5%; Supplier: Digi-Key; ComponentLink2Description: Datasheet; ComponentLink2URL: https://content.kemet.com/datasheets/KEM_C1002_X7R_SMD.pdf
J5 = FTR-110-51-L-D-06: CONN HEADER SMD 20POS 1.27MM; Manufacturer: SAMTEC; Manufacturer Part No.: FTR-110-51-L-D-06; Supplier: Digi-Key; Mounting Technology: SMD; Supplier Part No.: SAM11229-ND; Package Description: Header 2x10 1.7MM; Datasheet: *; Package Reference: HEADER_2X10_1.7MM
R16 R18 R70 R71 R73 = RC0603JR-070RL: as R77 on sheet SOM_Power; Manufacturer Part No.: RC0603JR-070RL; Date: 2020; ComponentLink1Description: Manufacturer Link; ComponentLink1URL: http://www.vishay.com/company/brands/dale/; ComponentLink2Description: Datasheet; ComponentLink2URL: http://www.vishay.com/docs/20035/dcrcwe3.pdf; Supplier: Digikey; Supplier Part No.: 311-0.0GRCT-ND; Datasheet: https://www.yageo.com/upload/media/product/productsearch/datasheet/rchip/PYu-RC_Group_51_RoHS_L_10.pdf; Package Reference: RES_0603; Package Description: 0603; Mounting Technology: SMD; Value: 0; Power Rating: 1/10W
R69 R72 = RC0603JR-071ML: RES SMD 1M OHM 5% 1/10W 0603; Manufacturer: Yageo; Tolerance: 5%; Manufacturer Part No.: RC0603JR-071ML; Date: 2020; ComponentLink1Description: Manufacturer Link; ComponentLink1URL: http://www.vishay.com/company/brands/dale/; ComponentLink2Description: Datasheet; ComponentLink2URL: http://www.vishay.com/docs/20035/dcrcwe3.pdf; Supplier: Digikey; Supplier Part No.: 311-1.0MGRCT-ND; Datasheet: https://www.yageo.com/upload/media/product/productsearch/datasheet/rchip/PYu-RC_Group_51_RoHS_L_10.pdf; Package Reference: RES_0603; Package Description: 0603; Mounting Technology: SMD; Value: 1M; Power Rating: 1/10W
R74-R76 = RC0603JR-074K7L: RES SMD 4.7K OHM 5% 1/10W 0603; Manufacturer: Yageo; Value: 4.7K; Tolerance: 5%; Manufacturer Part No.: RC0603JR-074K7L; Date: 2020; ComponentLink1Description: Manufacturer Link; ComponentLink1URL: http://www.vishay.com/company/brands/dale/; ComponentLink2Description: Datasheet; ComponentLink2URL: http://www.vishay.com/docs/20035/dcrcwe3.pdf; Supplier: Digikey; Supplier Part No.: 311-4.7KGRCT-ND; Datasheet: https://www.yageo.com/upload/media/product/productsearch/datasheet/rchip/PYu-RC_Group_51_RoHS_L_10.pdf; Package Reference: RES_0603; Package Description: 0603; Mounting Technology: SMD; Power Rating: 1/10W
U3 = SOM-OSD3358-512M-BSM: as U3 on sheet SOM_Power; Package: FBGA; Pin Count: 256-ball; Mounting Technology: SMD; ComponentLink1Description: Manufacturer URL; ComponentLink1URL: http://www.octavosystems.com/; PartNumber: OSD3358-512M-BSM; Package Description: 256-Ball Grid Array, 21x21x3 mm, Pitch 1.27 mm; Package Reference: FBGA-256; Supplier: Digi-Key; Supplier Part No.: 1676-1002-ND
Y1 = 7A-24.000MAAJ-T: CRYSTAL 24.0000MHZ 18PF SMD; Manufacturer: TXC CORPORATION; Date: 2020; ComponentLink1Description: Manufacturer Link; ComponentLink1URL: http://www.ecsxtal.com/; ComponentLink2Description: Data Sheet; Supplier Part No.: 887-1090-1-ND; Supplier: Digikey; Package Reference: 7A-24MHz; Package Description: 7A-24MHz; Mounting Technology: SMD; Manufacturer Part No.: 7A-24.000MAAJ-T; Datasheet: CRYSTAL 24.0000MHZ 18PF SMD; Value: 24 MHz
Y2 = ABS07-32.768KHZ-T: CRYSTAL 32.7680KHZ 12.5PF SMD; Manufacturer: Abracon LLC; Date: 2020; ComponentLink1Description: Manufacturer Link; ComponentLink1URL: http://www.ecsxtal.com/; ComponentLink2Description: Data Sheet; Supplier Part No.: 535-9542-1-ND; Supplier: Digikey; Package Reference: ABS07; Package Description: ABS07; Mounting Technology: SMD; Manufacturer Part No.: ABS07-32.768KHZ-T; Value: 32.768 KHz